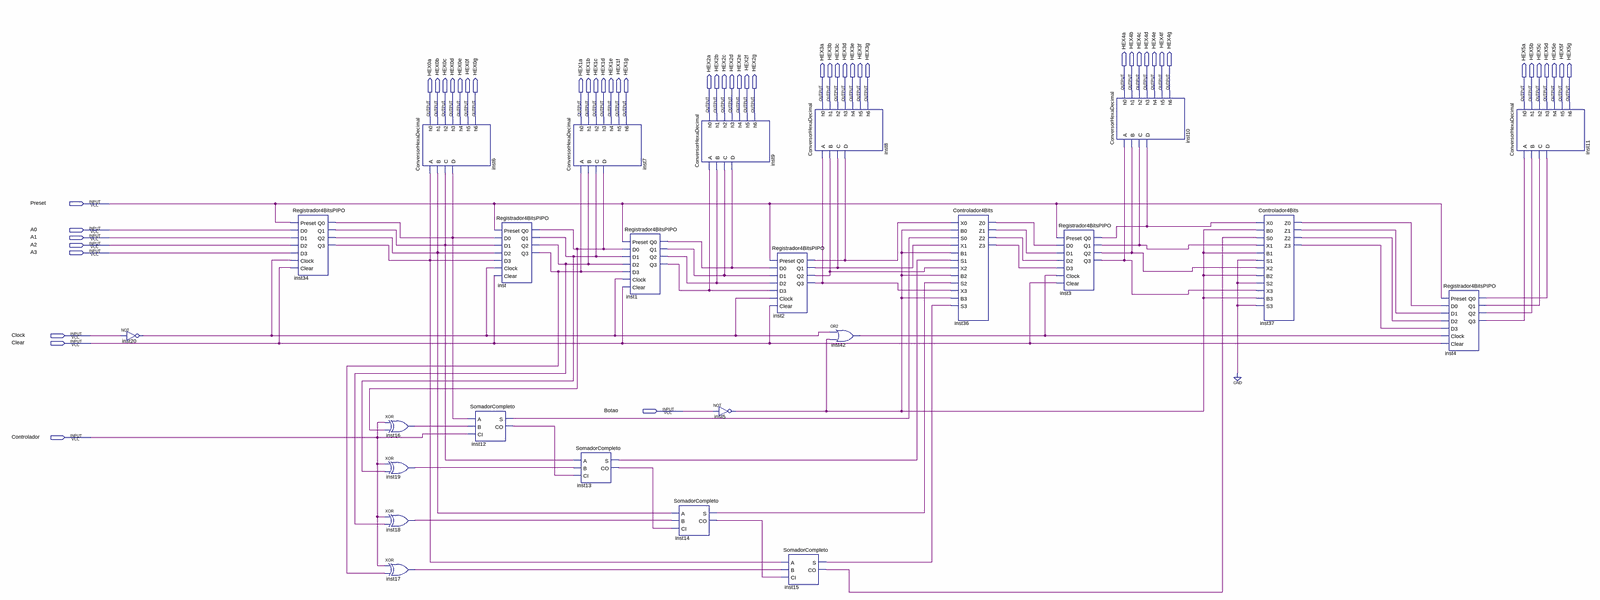
[diagram p0: schematic sheet, whole]
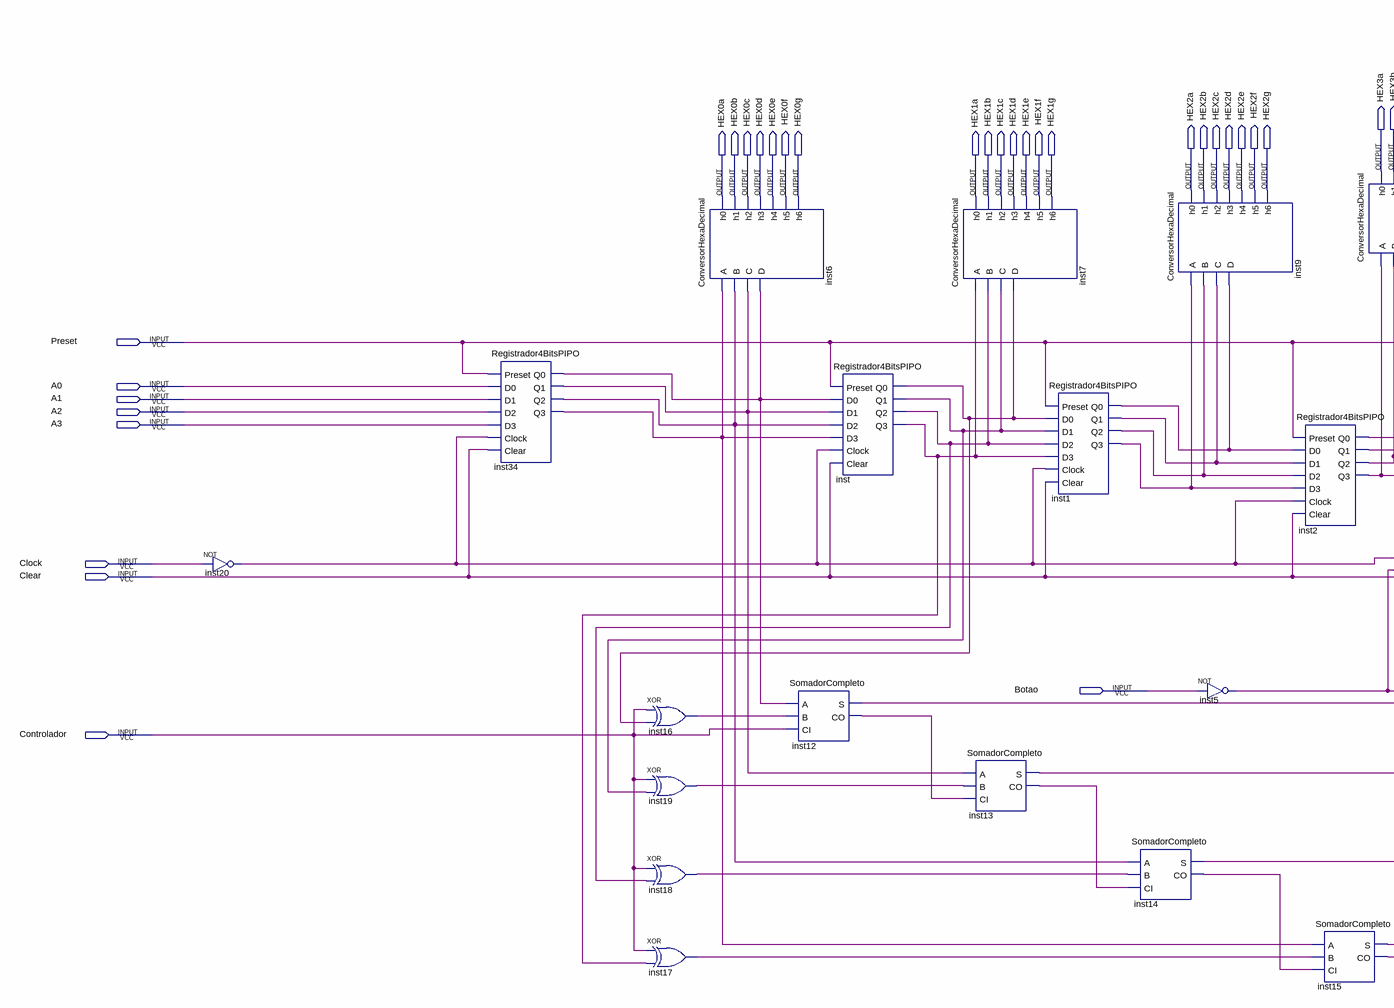
[diagram p1: schematic sheet, left part]
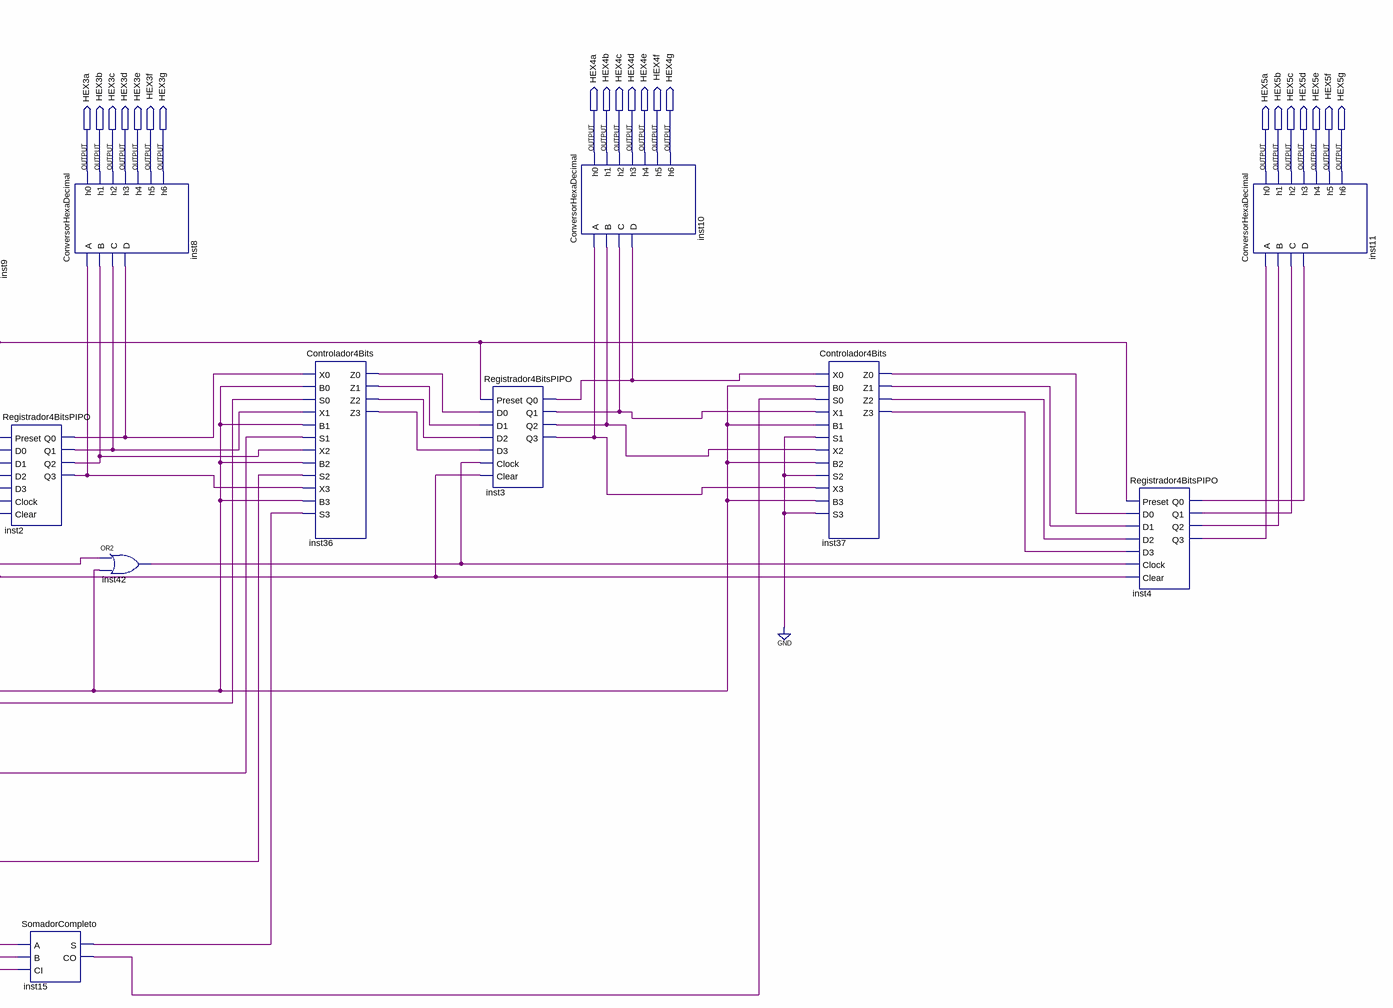
[diagram p2: schematic sheet, right part]
// Quartus schematic Registradores.bdf as structural Verilog: 25 symbols, 51 pins
module Registradores (
  input  Preset,
  input  A0,
  input  A1,
  input  A2,
  input  A3,
  input  Clock,
  input  Clear,
  input  Botao,
  input  Controlador,
  output HEX4a,
  output HEX4b,
  output HEX4c,
  output HEX4d,
  output HEX4e,
  output HEX4f,
  output HEX4g,
  output HEX3a,
  output HEX3b,
  output HEX3c,
  output HEX3d,
  output HEX3e,
  output HEX3f,
  output HEX3g,
  output HEX5a,
  output HEX5b,
  output HEX5c,
  output HEX5d,
  output HEX5e,
  output HEX5f,
  output HEX5g,
  output HEX2a,
  output HEX2b,
  output HEX2c,
  output HEX2d,
  output HEX2e,
  output HEX2f,
  output HEX2g,
  output HEX0a,
  output HEX0b,
  output HEX0c,
  output HEX0d,
  output HEX0e,
  output HEX0f,
  output HEX0g,
  output HEX1a,
  output HEX1b,
  output HEX1c,
  output HEX1d,
  output HEX1e,
  output HEX1f,
  output HEX1g
);

  wire inst1_q0, inst1_q1, inst1_q2, inst1_q3, inst2_q0, inst2_q1, inst2_q2, inst2_q3, inst3_q0, inst3_q1,
       inst3_q2, inst3_q3, inst4_q0, inst4_q1, inst4_q2, inst4_q3, inst5_out, inst12_co, inst12_s, inst13_co,
       inst13_s, inst14_co, inst14_s, inst15_co, inst15_s, inst16_out, inst17_out, inst18_out, inst19_out,
       inst20_out, inst34_q0, inst34_q1, inst34_q2, inst34_q3, inst36_z0, inst36_z1, inst36_z2, inst36_z3,
       inst37_z0, inst37_z1, inst37_z2, inst37_z3, inst42_out, inst_q0, inst_q1, inst_q2, inst_q3;

  not inst20 (inst20_out, Clock);
  Registrador4BitsPIPO inst34 (
    .Preset(Preset), .D0(A0), .D1(A1), .D2(A2), .D3(A3), .Clock(inst20_out), .Clear(Clear), .Q0(inst34_q0),
    .Q1(inst34_q1), .Q2(inst34_q2), .Q3(inst34_q3));
  xor inst16 (inst16_out, Controlador, inst_q0);
  xor inst19 (inst19_out, Controlador, inst_q1);
  xor inst18 (inst18_out, Controlador, inst_q2);
  xor inst17 (inst17_out, Controlador, inst_q3);
  ConversorHexaDecimal inst6 (
    .A(inst34_q3), .B(inst34_q2), .C(inst34_q1), .D(inst34_q0), .h0(HEX0a), .h1(HEX0b), .h2(HEX0c),
    .h3(HEX0d), .h4(HEX0e), .h5(HEX0f), .h6(HEX0g));
  SomadorCompleto inst12 (.A(inst34_q0), .B(inst16_out), .CI(Controlador), .S(inst12_s), .CO(inst12_co));
  Registrador4BitsPIPO inst (
    .Preset(Preset), .D0(inst34_q0), .D1(inst34_q1), .D2(inst34_q2), .D3(inst34_q3), .Clock(inst20_out),
    .Clear(Clear), .Q0(inst_q0), .Q1(inst_q1), .Q2(inst_q2), .Q3(inst_q3));
  ConversorHexaDecimal inst7 (
    .A(inst_q3), .B(inst_q2), .C(inst_q1), .D(inst_q0), .h0(HEX1a), .h1(HEX1b), .h2(HEX1c), .h3(HEX1d),
    .h4(HEX1e), .h5(HEX1f), .h6(HEX1g));
  SomadorCompleto inst13 (.A(inst34_q1), .B(inst19_out), .CI(inst12_co), .S(inst13_s), .CO(inst13_co));
  Registrador4BitsPIPO inst1 (
    .Preset(Preset), .D0(inst_q0), .D1(inst_q1), .D2(inst_q2), .D3(inst_q3), .Clock(inst20_out),
    .Clear(Clear), .Q0(inst1_q0), .Q1(inst1_q1), .Q2(inst1_q2), .Q3(inst1_q3));
  ConversorHexaDecimal inst9 (
    .A(inst1_q3), .B(inst1_q2), .C(inst1_q1), .D(inst1_q0), .h0(HEX2a), .h1(HEX2b), .h2(HEX2c), .h3(HEX2d),
    .h4(HEX2e), .h5(HEX2f), .h6(HEX2g));
  SomadorCompleto inst14 (.A(inst34_q2), .B(inst18_out), .CI(inst13_co), .S(inst14_s), .CO(inst14_co));
  not inst5 (inst5_out, Botao);
  Registrador4BitsPIPO inst2 (
    .Preset(Preset), .D0(inst1_q0), .D1(inst1_q1), .D2(inst1_q2), .D3(inst1_q3), .Clock(inst20_out),
    .Clear(Clear), .Q0(inst2_q0), .Q1(inst2_q1), .Q2(inst2_q2), .Q3(inst2_q3));
  SomadorCompleto inst15 (.A(inst34_q3), .B(inst17_out), .CI(inst14_co), .S(inst15_s), .CO(inst15_co));
  ConversorHexaDecimal inst8 (
    .A(inst2_q3), .B(inst2_q2), .C(inst2_q1), .D(inst2_q0), .h0(HEX3a), .h1(HEX3b), .h2(HEX3c), .h3(HEX3d),
    .h4(HEX3e), .h5(HEX3f), .h6(HEX3g));
  or inst42 (inst42_out, inst20_out, inst5_out);
  Controlador4Bits inst36 (
    .X0(inst2_q0), .B0(inst5_out), .S0(inst12_s), .X1(inst2_q1), .B1(inst5_out), .S1(inst13_s),
    .X2(inst2_q2), .B2(inst5_out), .S2(inst14_s), .X3(inst2_q3), .B3(inst5_out), .S3(inst15_s),
    .Z0(inst36_z0), .Z1(inst36_z1), .Z2(inst36_z2), .Z3(inst36_z3));
  Registrador4BitsPIPO inst3 (
    .Preset(Preset), .D0(inst36_z0), .D1(inst36_z1), .D2(inst36_z2), .D3(inst36_z3), .Clock(inst42_out),
    .Clear(Clear), .Q0(inst3_q0), .Q1(inst3_q1), .Q2(inst3_q2), .Q3(inst3_q3));
  ConversorHexaDecimal inst10 (
    .A(inst3_q3), .B(inst3_q2), .C(inst3_q1), .D(inst3_q0), .h0(HEX4a), .h1(HEX4b), .h2(HEX4c), .h3(HEX4d),
    .h4(HEX4e), .h5(HEX4f), .h6(HEX4g));
  Controlador4Bits inst37 (
    .X0(inst3_q0), .B0(inst5_out), .S0(inst15_co), .X1(inst3_q1), .B1(inst5_out), .S1(1'b0), .X2(inst3_q2),
    .B2(inst5_out), .S2(1'b0), .X3(inst3_q3), .B3(inst5_out), .S3(1'b0), .Z0(inst37_z0), .Z1(inst37_z1),
    .Z2(inst37_z2), .Z3(inst37_z3));
  Registrador4BitsPIPO inst4 (
    .Preset(Preset), .D0(inst37_z0), .D1(inst37_z1), .D2(inst37_z2), .D3(inst37_z3), .Clock(inst42_out),
    .Clear(Clear), .Q0(inst4_q0), .Q1(inst4_q1), .Q2(inst4_q2), .Q3(inst4_q3));
  ConversorHexaDecimal inst11 (
    .A(inst4_q3), .B(inst4_q2), .C(inst4_q1), .D(inst4_q0), .h0(HEX5a), .h1(HEX5b), .h2(HEX5c), .h3(HEX5d),
    .h4(HEX5e), .h5(HEX5f), .h6(HEX5g));
endmodule
